# EAGLE design converter_LM394-2SC1583 (EAGLE 5.07)
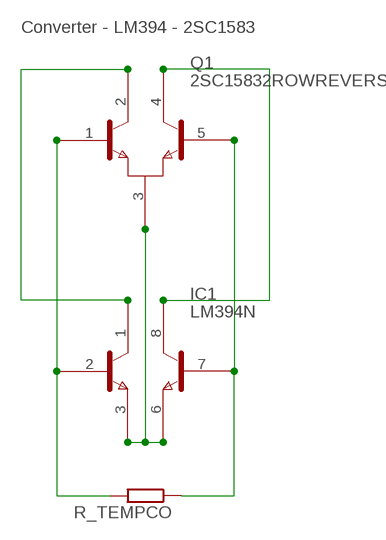
[diagram p0: schematic, sheet 1]

## Parts
IC1  LM394N  [DIL08]
Q1  2SC15832ROWREVERSE  [XSIST_SIP5_2ROW_REVERSE]
R_TEMPCO  R-EU_0207/7  [0207/7]

## Nets
N$1: IC1.2(B1) Q1.1(B1) R_TEMPCO.2
N$2: IC1.7(B2) Q1.5(B2) R_TEMPCO.1
N$3: IC1.3(E1) IC1.6(E2) Q1.3(E)
N$4: IC1.1(C1) Q1.2(C1)
N$5: IC1.8(C2) Q1.4(C2)

## Notes on the sheet
- Converter - LM394 - 2SC1583

## Library data of the parts
IC1 = synthdiy:LM394: National Dual TRANSISTOR
Q1 = synthdiy:2SC1583: Dual low noise NPN TRANSISTOR.
R_TEMPCO = resistor:R-EU_: RESISTOR, European symbol

## Board
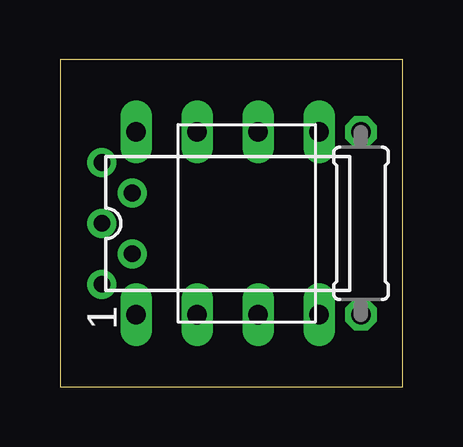
[diagram p1: board, top side]
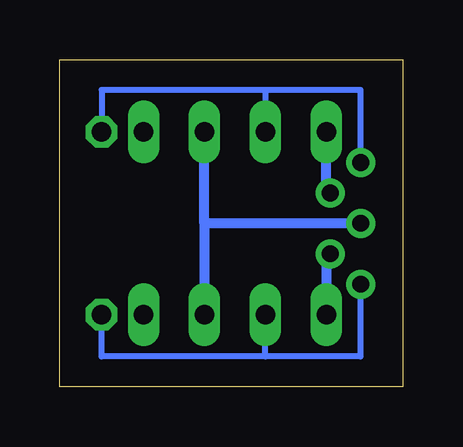
[diagram p2: board, bottom side, seen from below]

Size 14.28 x 13.64 mm. Coordinates in mm from the lower left corner, seen from the top.
Outline: 0,0 14.28,0 14.28,13.64 0,13.64 0,0
Copper layers (1*16): Top 0.035mm / dielectric 1.5mm / Bottom 0.035mm
Design rules "8mils": minimum track width 8mil, minimum drill 0.6mm, track to track 8mil, track to pad 8mil, pad to pad 8mil, via to via 8mil, smd to smd 8mil, copper to edge 40mil, drill to drill 10mil, minimum pad ring 10mil, minimum via ring 8mil, stop-mask expansion 0mil, vias tented up to drill 0mil, thermal gap 10mil

### Footprints (pad centres in the part's own frame; a part is rotated, then mirrored left to right if it is on the bottom)
DIL08 = drill 0.813 long: 1 -3.81,-3.81; 2 -1.27,-3.81; 3 1.27,-3.81; 4 3.81,-3.81; 5 3.81,3.81; 6 1.27,3.81; 7 -1.27,3.81; 8 -3.81,3.81
XSIST_SIP5_2ROW_REVERSE = drill 0.7 round: 1 -2.54,1.27; 2 -1.27,0; 3 0,1.27; 4 1.27,0; 5 2.54,1.27
0207/7 = drill 0.813 octagon: 1 -3.81,0; 2 3.81,0

### Placement (x,y rotation side)
IC1  6.99,6.83 0 top
Q1  3.02,6.83 90 top
R_TEMPCO  12.54,6.83 270 top

### Tracks (layer width: path | path; a pad name or v marks a point on that pad's centre or on a via)
N$1
  Bottom 0.254: Q1.1 1.75,1.43 1.75,1.27 5.71,1.27 | 5.71,1.27 12.54,1.27 R_TEMPCO.2 | 5.71,1.27 IC1.2
N$2
  Bottom 0.254: Q1.5 1.75,12.38 | 1.75,12.38 | 1.75,12.38 5.71,12.38 | 5.71,12.38 12.54,12.38 R_TEMPCO.1 | 5.71,12.38 IC1.7
N$3
  Bottom 0.406: Q1.3 8.26,6.83 | 8.26,6.83 IC1.6 | 8.26,6.83 IC1.3
N$4
  Bottom 0.406: Q1.2 3.17,5.58 IC1.1
N$5
  Bottom 0.406: Q1.4 3.17,8.08 IC1.8